# EAGLE schematic D (EAGLE 9.6.2)
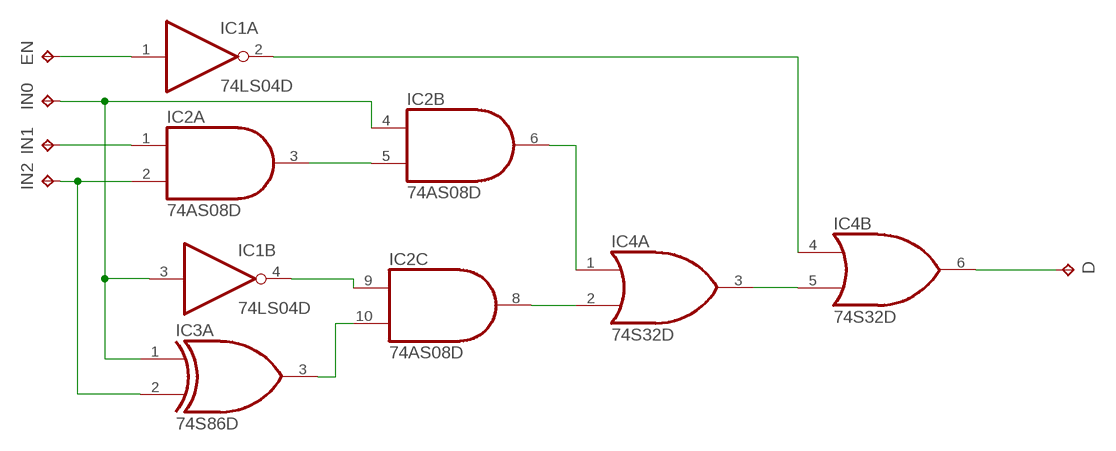
[diagram p0: schematic, sheet 1]

## Parts
D  TPB1,27  [B1,27]
EN  TPB1,27  [B1,27]
IC1  74LS04D  [SO14]
IC2  74AS08D  [SO14]
IC3  74S86D  [SO14]
IC4  74S32D  [SO14]
IN0  TPB1,27  [B1,27]
IN1  TPB1,27  [B1,27]
IN2  TPB1,27  [B1,27]

## Nets
N$1: IC2.2(A:I1) IC3.2(A:I1) IN2.TP
N$2: IC2.1(A:I0) IN1.TP
N$3: IC1.3(B:I) IC2.4(B:I0) IC3.1(A:I0) IN0.TP
N$4: IC2.3(A:O) IC2.5(B:I1)
N$5: IC2.6(B:O) IC4.1(A:I0)
N$6: IC2.10(C:I1) IC3.3(A:O)
N$7: IC2.8(C:O) IC4.2(A:I1)
N$8: EN.TP IC1.1(A:I)
N$9: IC1.4(B:O) IC2.9(C:I0)
N$10: IC1.2(A:O) IC4.4(B:I0)
N$11: IC4.3(A:O) IC4.5(B:I1)
N$12: D.TP IC4.6(B:O)
Unconnected: IC1.5(C:I) IC1.6(C:O) IC1.8(D:O) IC1.9(D:I) IC1.10(E:O) IC1.11(E:I) IC1.12(F:O) IC1.13(F:I) IC2.11(D:O) IC2.12(D:I0) IC2.13(D:I1) IC3.4(B:I0) IC3.5(B:I1) IC3.6(B:O) IC3.8(C:O) IC3.9(C:I0) IC3.10(C:I1) IC3.11(D:O) IC3.12(D:I0) IC3.13(D:I1) IC4.8(C:O) IC4.9(C:I0) IC4.10(C:I1) IC4.11(D:O) IC4.12(D:I0) IC4.13(D:I1)

## Power pins joined to a net without a drawn wire
GND: IC1.7(P:GND) IC2.7(P:GND) IC3.7(P:GND) IC4.7(P:GND)
VCC: IC1.14(P:VCC) IC2.14(P:VCC) IC3.14(P:VCC) IC4.14(P:VCC)

## Library data of the parts
D EN IN0 IN1 IN2 = testpad:TP: Test pad
IC1 = 74xx-us:74*04: Hex INVERTER
IC2 = 74xx-us:74*08: Quad 2-input AND gate
IC3 = 74xx-us:74*86: Quad 2-input EXCLUSIV-OR (XOR) gate
IC4 = 74xx-us:74*32: Quad 2-input OR gate